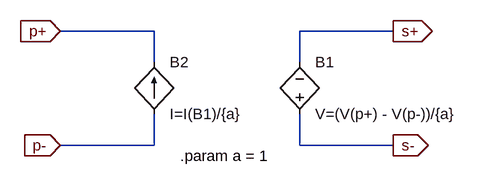
[diagram p0: schematic Trafo_Ideal_Componente.asc]
Trafo_Ideal_Componente.asc, the LTspice schematic file:
Version 4
SHEET 1 880 680
WIRE 112 80 -32 80
WIRE 480 80 336 80
WIRE 112 128 112 80
WIRE 336 128 336 80
WIRE 112 256 112 208
WIRE 112 256 -32 256
WIRE 336 256 336 208
WIRE 480 256 336 256
FLAG -32 80 p+
IOPIN -32 80 In
FLAG -32 256 p-
IOPIN -32 256 In
FLAG 480 80 s+
IOPIN 480 80 Out
FLAG 480 256 s-
IOPIN 480 256 Out
SYMBOL bv 336 224 M180
WINDOW 0 24 96 Left 2
WINDOW 3 24 16 Left 2
SYMATTR InstName B1
SYMATTR Value V=(V(p+) - V(p-))/{a}
SYMBOL bi2 112 128 R0
SYMATTR InstName B2
SYMATTR Value I=I(B1)/{a}
TEXT 152 272 Left 2 !.param a = 1

The netlist it stands for:
* Trafo_Ideal_Componente.asc
B1 s- s+ V=(V(p+) - V(p-))/{a}
B2 p- p+ I=I(B1)/{a}
.param a = 1
.backanno
.end